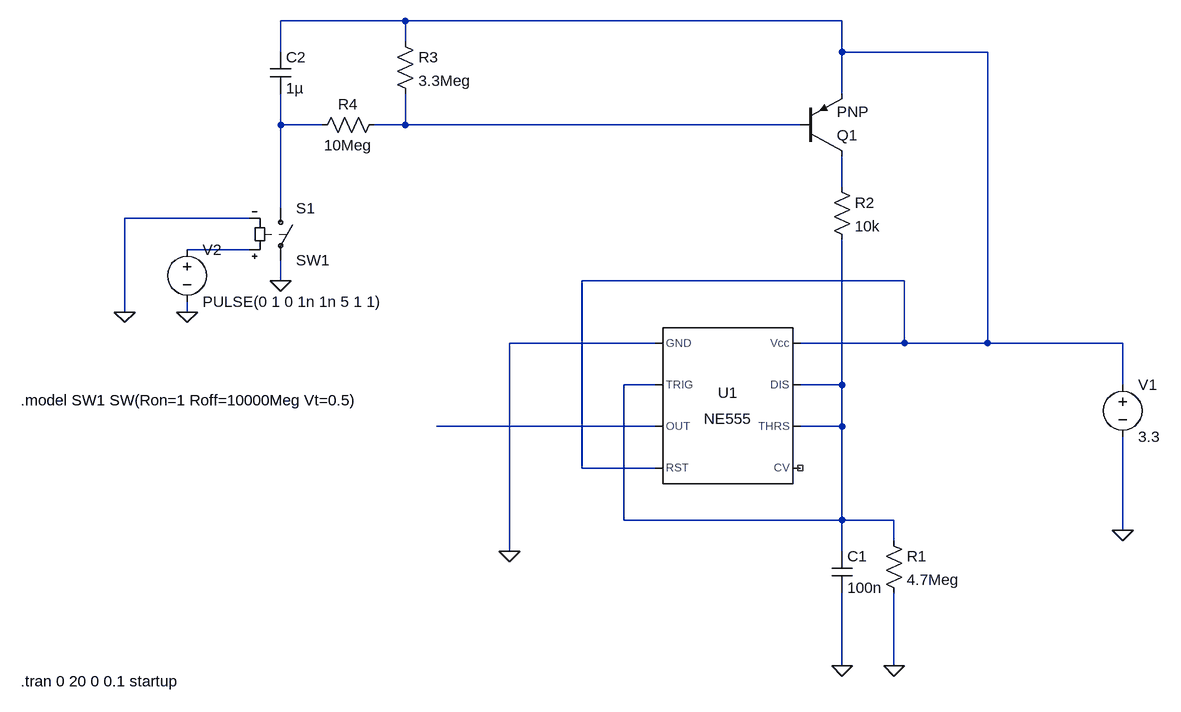
[diagram p0: schematic Timer.asc]
Timer.asc, the LTspice schematic file:
Version 4
SHEET 1 1064 680
WIRE -336 -464 -528 -464
WIRE 336 -464 -336 -464
WIRE -336 -432 -336 -464
WIRE -528 -416 -528 -464
WIRE 336 -416 336 -464
WIRE 560 -416 336 -416
WIRE 336 -352 336 -416
WIRE -528 -304 -528 -352
WIRE -464 -304 -528 -304
WIRE -336 -304 -336 -352
WIRE -336 -304 -384 -304
WIRE 272 -304 -336 -304
WIRE 336 -208 336 -256
WIRE -528 -176 -528 -304
WIRE -576 -160 -768 -160
WIRE -576 -112 -672 -112
WIRE -528 -64 -528 -96
WIRE 432 -64 -64 -64
WIRE -768 -16 -768 -160
WIRE -672 -16 -672 -32
WIRE 48 32 -176 32
WIRE 432 32 432 -64
WIRE 432 32 272 32
WIRE 560 32 560 -416
WIRE 560 32 432 32
WIRE 768 32 560 32
WIRE 48 96 0 96
WIRE 336 96 336 -128
WIRE 336 96 272 96
WIRE 768 96 768 32
WIRE 48 160 -288 160
WIRE 336 160 336 96
WIRE 336 160 272 160
WIRE -64 224 -64 -64
WIRE 48 224 -64 224
WIRE 0 304 0 96
WIRE 336 304 336 160
WIRE 336 304 0 304
WIRE 416 304 336 304
WIRE 768 320 768 176
WIRE 416 336 416 304
WIRE -176 352 -176 32
WIRE 336 352 336 304
WIRE 336 528 336 416
WIRE 416 528 416 416
FLAG -176 352 0
FLAG 768 320 0
FLAG 336 528 0
FLAG -528 -64 0
FLAG -768 -16 0
FLAG -672 -16 0
FLAG 416 528 0
SYMBOL Misc\\NE555 160 128 R0
SYMATTR InstName U1
SYMBOL voltage 768 80 R0
WINDOW 123 0 0 Left 0
WINDOW 39 0 0 Left 0
SYMATTR InstName V1
SYMATTR Value 3.3
SYMBOL cap 320 352 R0
SYMATTR InstName C1
SYMATTR Value 100n
SYMBOL res 400 320 R0
SYMATTR InstName R1
SYMATTR Value 4.7Meg
SYMBOL res 320 -224 R0
SYMATTR InstName R2
SYMATTR Value 10k
SYMBOL pnp 272 -256 M180
SYMATTR InstName Q1
SYMBOL res -352 -448 R0
SYMATTR InstName R3
SYMATTR Value 3.3Meg
SYMBOL res -368 -320 R90
WINDOW 0 0 56 VBottom 2
WINDOW 3 32 56 VTop 2
SYMATTR InstName R4
SYMATTR Value 10Meg
SYMBOL cap -544 -416 R0
SYMATTR InstName C2
SYMATTR Value 1µ
SYMBOL sw -528 -192 R0
SYMATTR InstName S1
SYMATTR Value SW1
SYMBOL voltage -672 -128 R0
WINDOW 123 0 0 Left 0
WINDOW 39 0 0 Left 0
SYMATTR InstName V2
SYMATTR Value PULSE(0 1 0 1n 1n 5 1 1)
TEXT -928 120 Left 2 !.model SW1 SW(Ron=1 Roff=10000Meg Vt=0.5)
TEXT -928 552 Left 2 !.tran 0 20 0 0.1 startup

The netlist it stands for:
* Timer.asc
XU1 0 N006 N007 N001 NC_01 N006 N006 N001 NE555  ; pins GND TRIG OUT RST CV THRS DIS Vcc
V1 N001 0 3.3
C1 N006 0 100n
R1 N006 0 4.7Meg
R2 N004 N006 10k
Q1 N004 N003 N001 0 PNP
R3 N001 N003 3.3Meg
R4 N003 N002 10Meg
C2 N001 N002 1µ
S1 N002 0 N005 0 SW1
V2 N005 0 PULSE(0 1 0 1n 1n 5 1 1)
.model NPN NPN
.model PNP PNP
.lib standard.bjt
.model SW1 SW(Ron=1 Roff=10000Meg Vt=0.5)
.tran 0 20 0 0.1 startup
.lib NE555.sub
.backanno
.end